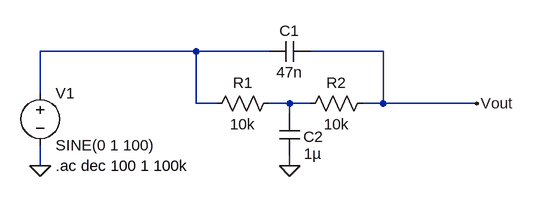
[diagram p0: schematic Bridged_T_Notch_Filter.asc]
Bridged_T_Notch_Filter.asc, the LTspice schematic file:
Version 4
SHEET 1 1712 1132
WIRE 800 -176 560 -176
WIRE 912 -176 800 -176
WIRE 1088 -176 976 -176
WIRE 560 -112 560 -176
WIRE 800 -96 800 -176
WIRE 832 -96 800 -96
WIRE 944 -96 912 -96
WIRE 976 -96 944 -96
WIRE 1088 -96 1088 -176
WIRE 1088 -96 1056 -96
WIRE 1232 -96 1088 -96
WIRE 944 -80 944 -96
WIRE 560 0 560 -32
WIRE 944 0 944 -16
FLAG 1232 -96 Vout
FLAG 560 0 0
FLAG 944 0 0
SYMBOL res 928 -112 R90
WINDOW 0 0 56 VBottom 2
WINDOW 3 32 56 VTop 2
SYMATTR InstName R1
SYMATTR Value 10k
SYMBOL res 1072 -112 R90
WINDOW 0 0 56 VBottom 2
WINDOW 3 32 56 VTop 2
SYMATTR InstName R2
SYMATTR Value 10k
SYMBOL voltage 560 -128 R0
SYMATTR InstName V1
SYMATTR Value SINE(0 1 100)
SYMATTR Value2 AC 1
SYMBOL cap 976 -192 R90
WINDOW 0 0 32 VBottom 2
WINDOW 3 32 32 VTop 2
SYMATTR InstName C1
SYMATTR Value 47n
SYMATTR SpiceLine mfg="   ---" pn="   ---" type="   ---"
SYMBOL cap 960 -16 R180
WINDOW 0 -36 29 Left 2
WINDOW 3 -33 3 Left 2
SYMATTR InstName C2
SYMATTR Value 1µ
SYMATTR SpiceLine mfg="   ---" pn="   ---" type="   ---"
TEXT 584 0 Left 2 !.ac dec 100 1 100k

The netlist it stands for:
* Bridged_T_Notch_Filter.asc
R1 N002 N001 10k
R2 Vout N002 10k
V1 N001 0 SINE(0 1 100) AC 1
C1 Vout N001 47n mfg="   ---" pn="   ---" type="   ---"
C2 0 N002 1µ mfg="   ---" pn="   ---" type="   ---"
.ac dec 100 1 100k
.backanno
.end